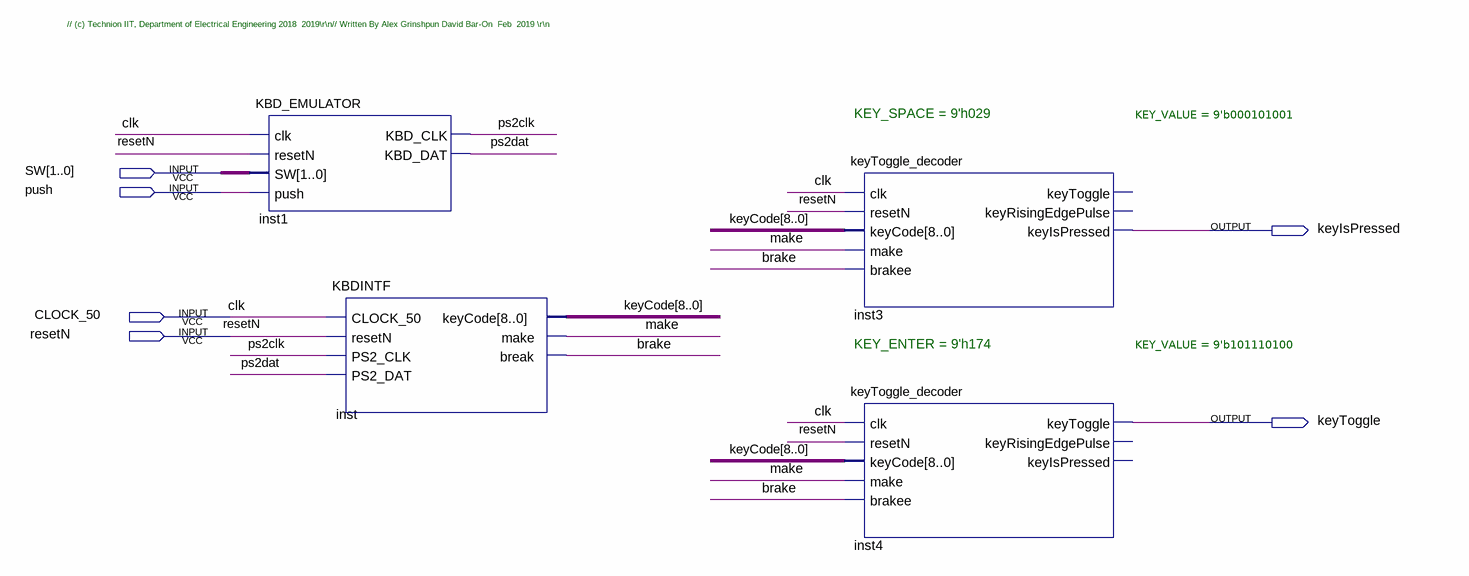
[diagram p0: schematic sheet]
// Quartus schematic TOP_KBD_DEMO.bdf as structural Verilog: 4 symbols, 6 pins
module TOP_KBD_DEMO (
  input  [1:0] SW,
  input  push,
  input  CLOCK_50,
  input  resetN,
  output keyIsPressed,
  output keyToggle
);

  wire brake, make, ps2clk, ps2dat;
  wire [8:0] keyCode;

  KBD_EMULATOR inst1 (.clk(CLOCK_50), .resetN(resetN), .SW(SW), .push(push), .KBD_CLK(ps2clk), .KBD_DAT(ps2dat));
  KBDINTF inst (
    .CLOCK_50(CLOCK_50), .resetN(resetN), .PS2_CLK(ps2clk), .PS2_DAT(ps2dat), .keyCode(keyCode), .make(make),
    .\break (brake));
  keyToggle_decoder #(.KEY_VALUE(9'b000101001)) inst3 (
    .clk(CLOCK_50), .resetN(resetN), .keyCode(keyCode), .make(make), .brakee(brake),
    .keyIsPressed(keyIsPressed));  // open: keyToggle, keyRisingEdgePulse
  keyToggle_decoder #(.KEY_VALUE(9'b101110100)) inst4 (
    .clk(CLOCK_50), .resetN(resetN), .keyCode(keyCode), .make(make), .brakee(brake), .keyToggle(keyToggle));  // open: keyRisingEdgePulse, keyIsPressed

  // Other names for the same wires on the sheet: clk = CLOCK_50

  // Notes on the sheet:
  //   // (c) Technion IIT, Department of Electrical Engineering 2018  2019\r\n// Written By Alex Grinshpun David Bar-On  Feb  2019 \r\n
  //   KEY_SPACE = 9'h029
  //   KEY_ENTER = 9'h174
endmodule
